# Altium schematic sheet Input.SchDoc: Input
size A4; Address1: Smoka Wawelskiego 1; Address2: 30-535 Kraków, Poland; DocumentNumber: 2; Revision: v01; SheetNumber: 2; SheetTotal: 9; Author: Miroslaw Folejewski; CompanyName: Mirko Electronics; DrawnBy: Miroslaw Folejewski; Engineer: Miroslaw Folejewski; PageSetup: Record=PageOptions|CenterHorizontal=True|CenterVertical=True|PrintScale=1.00|XCorrection=1.00|YCorrection=1.00|PrintKind=0|BorderSize=5000000|LeftOffset=0|BottomOffset=0|Orientation=2|PaperLength=1000|PaperWidth=1000|Scale=100|PaperSource=7|PrintQuality=-4|MediaType=1|DitherType=10|PaperKind=A4|PrintScaleMode=1; PageSize: A4; Designators: -; ProjectName: 7-Segment LED Matrix Display
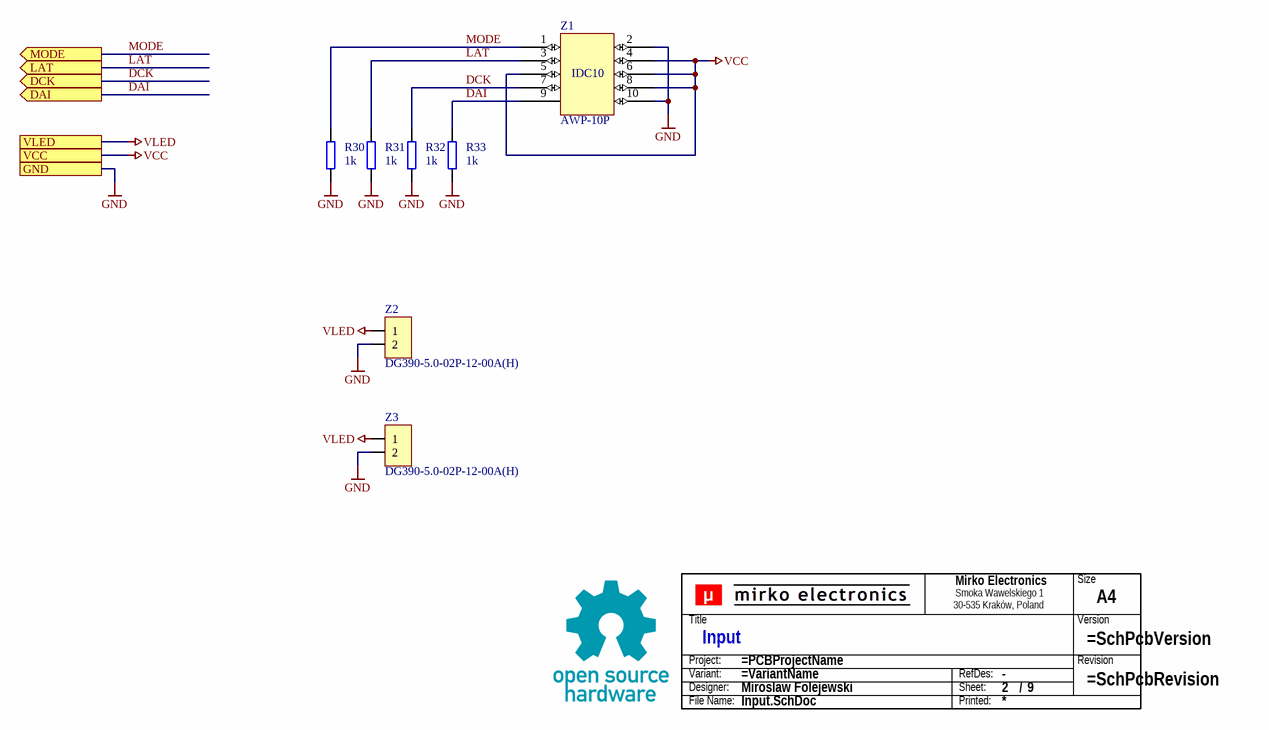
[diagram p0: Input.SchDoc]

## Parts
?  (no value)  (graphical)
R30  1k  [0805]
R31  1k  [0805]
R32  1k  [0805]
R33  1k  [0805]
TB?  Title block  (value not drawn)  (graphical)
Z1  AWP-10P  [BH10S]
Z2  DG390-5.0-02P-12-00A(H)  [WAGO2X2-5]
Z3  DG390-5.0-02P-12-00A(H)  [WAGO2X2-5]

## Ports
DAI (out), DCK (out), GND, LAT (out), MODE (out), VCC, VLED

## Nets
GND: R30.1 R31.1 R32.1 R33.1 Z1.2 Z1.10 Z2.2 Z3.2 ; port GND
VCC: Z1.4 Z1.5 Z1.6 Z1.8 ; port VCC
VLED: Z2.1 Z3.1 ; port VLED
DAI: R33.2 Z1.9 ; port DAI
DCK: R32.2 Z1.7 ; port DCK
LAT: R31.2 Z1.3 ; port LAT
MODE: R30.2 Z1.1 ; port MODE

## Notes on the sheet
- Title
- Size
- Revision
- Checked By:
- Project:
- Variant:
- Engineer:
- Date:
- Sheet:
- /
- Designators
- Approved By:
- File:
- (in symbol SCH_TITLE_BLOCK_V1) Size; Title; Version; Project:; Revision; Variant:; RefDes:; Designer:; Sheet:; /; File Name:; Printed:

## Library data of the parts
? = Title Block NeoStrain
R30-R33 = R0805
TB? = SCH_TITLE_BLOCK_V1: Component Type: Title block; Manufacturer: -; Mounting Type: Non component; MPN: -; Operating Temperature: -; Package: -; Specification: Title block; Value: Title block; Replacement: -; System: ?
Z1 = IDC10
Z2 Z3 = CON2: Connector